# Altium schematic sheet 2024-08-23_02-39-061.schdoc
size 378 x 175 mm; SheetNumber: 1; SheetTotal: 1
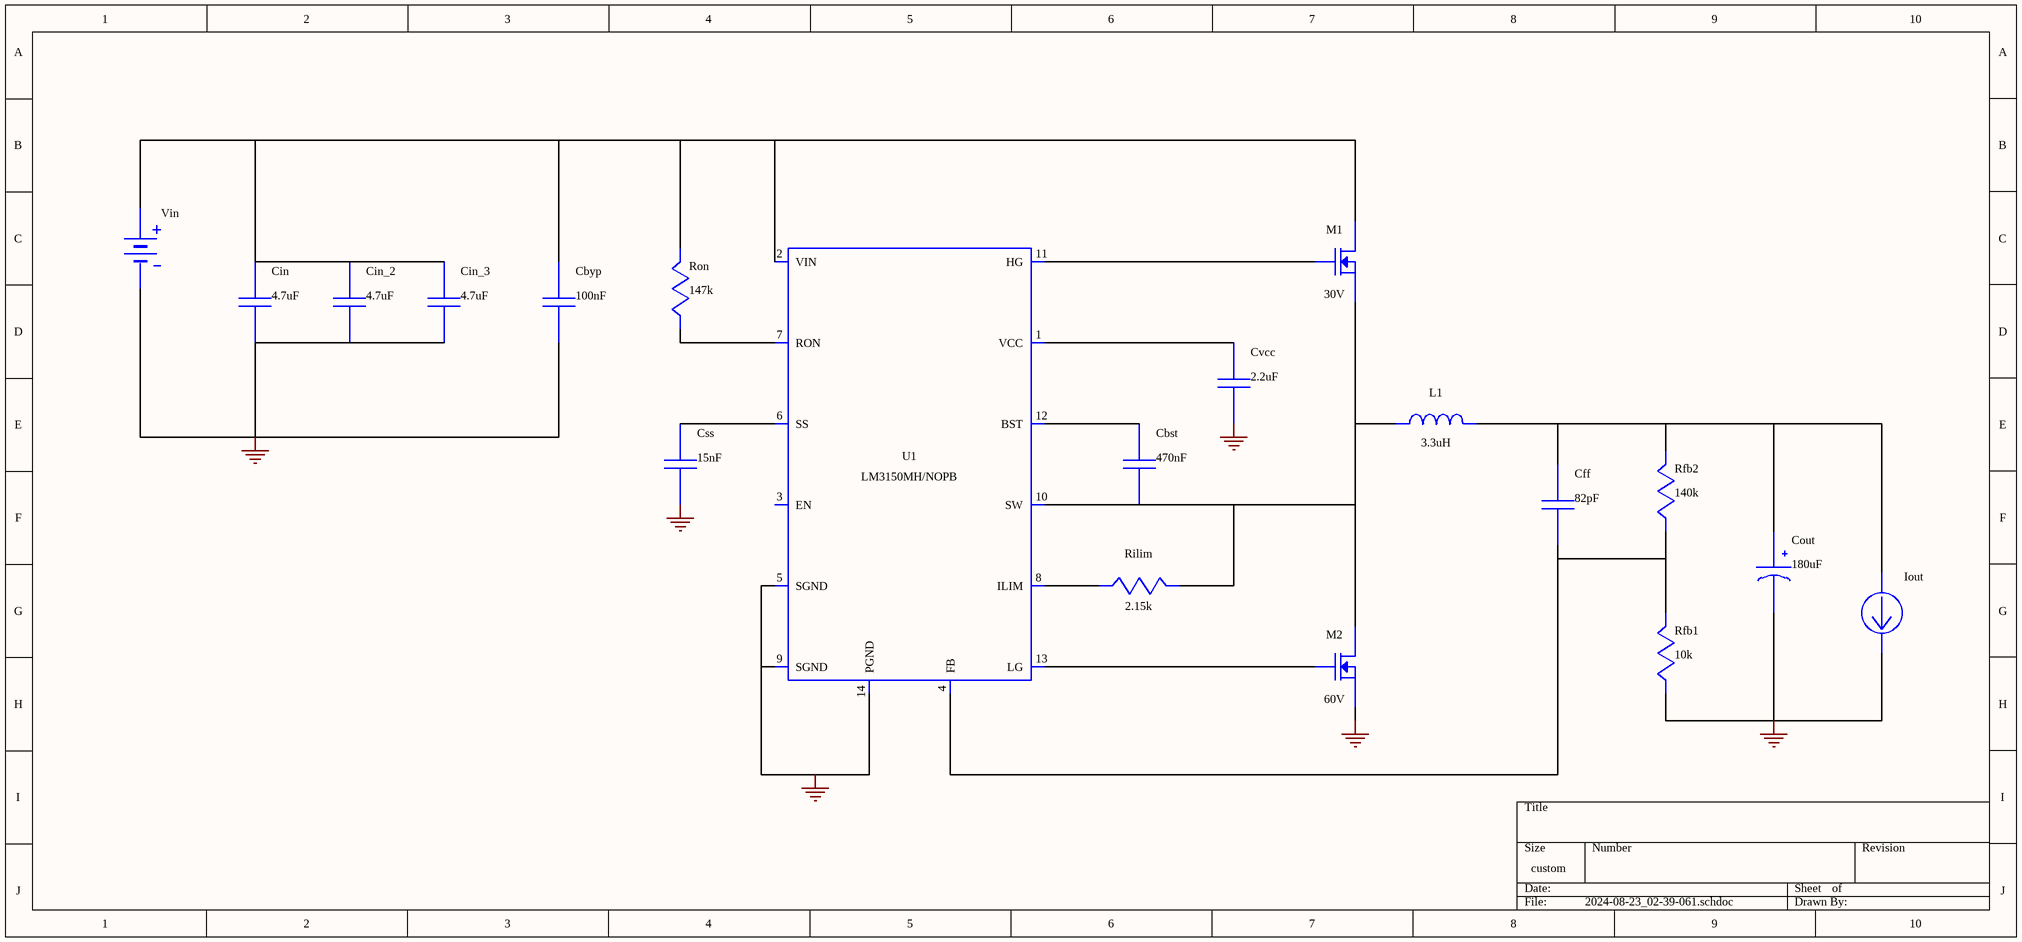
[diagram p0: 2024-08-23_02-39-061.schdoc]

## Parts
Cbst  value 470nF  (hidden comment: ECPU1C474MA5)
Cbyp  value 100nF  (hidden comment: C0805C104M5RACTU)
Cff  value 82pF  (hidden comment: CC0805JRNPO9BN820)
Cin  value 4.7uF  (hidden comment: GRM31CR71H475KA12L)
Cin_2  value 4.7uF  (hidden comment: GRM31CR71H475KA12L)
Cin_3  value 4.7uF  (hidden comment: GRM31CR71H475KA12L)
Cout  value 180uF  (hidden comment: 16SVPE180M)
Css  value 15nF  (hidden comment: C2012C0G1H153J085AA)
Cvcc  value 2.2uF  (hidden comment: GRM21BR71A225KA01L)
Iout  WB_CURRENT_LOAD  (value not drawn)
L1  value 3.3uH  (hidden comment: SRP1270-3R3M)
M1  value 30V  (hidden comment: CSD17302Q5A)
M2  value 60V  (hidden comment: CSD18533Q5A)
Rfb1  value 10k  (hidden comment: ERJ-6ENF1002V)
Rfb2  value 140k  (hidden comment: ERJ-6ENF1403V)
Rilim  value 2.15k  (hidden comment: ERJ-6ENF2151V)
Ron  value 147k  (hidden comment: ERJ-6ENF1473V)
U1  LM3150MH/NOPB
Vin  WB_BATTERY  (value not drawn)

## Nets
0: Cbyp.2 Cin.2 Cin_2.2 Cin_3.2 Cout.2(-) Css.2 Cvcc.2 Iout.2(-) M2.1(Source) M2.2(Source) M2.3(Source) Rfb1.2 U1.5(SGND) U1.9(SGND) U1.14(PGND) U1.15(DAP) Vin.2(-)
NetCbst_1: Cbst.1 U1.12(BST)
NetCbst_2: Cbst.2 L1.1 M1.1(Source) M1.2(Source) M1.3(Source) M2.5(Drain) M2.6(Drain) M2.7(Drain) M2.8(Drain) M2.9(Drain) Rilim.1 U1.10(SW)
NetCbyp_1: Cbyp.1 Cin.1 Cin_2.1 Cin_3.1 M1.5(Drain) M1.6(Drain) M1.7(Drain) M1.8(Drain) M1.9(Drain) Ron.1 U1.2(VIN) Vin.1(+)
NetCff_1: Cff.1 Cout.1(+) Iout.1(+) L1.2 Rfb2.1
NetCff_2: Cff.2 Rfb1.1 Rfb2.2 U1.4(FB)
NetCss_1: Css.1 U1.6(SS)
NetCvcc_1: Cvcc.1 U1.1(VCC)
NetM1_4: M1.4(Gate) U1.11(HG)
NetM2_4: M2.4(Gate) U1.13(LG)
NetRilim_2: Rilim.2 U1.8(ILIM)
NetRon_2: Ron.2 U1.7(RON)

Not connected (* = marked no-connect by the designer): U1 3(EN)

## Library data of the parts
Cbst = ECPU1C474MA5: Manufacturer Name: Panasonic; PackageReference: ECPU1C474MA5; Manufacturer Part Number: ECPU1C474MA5
Cbyp = C0805C104M5RACTU: Manufacturer Name: Kemet; PackageReference: C0805C104M5RACTU; Manufacturer Part Number: C0805C104M5RACTU
Cff = CC0805JRNPO9BN820: CC0805JRNPO9BN82; Manufacturer Name: Yageo; PackageReference: CC0805JRNPO9BN820; Manufacturer Part Number: CC0805JRNPO9BN820
Cin Cin_2 Cin_3 = GRM31CR71H475KA12L: GRM31CR71H475KA1; Manufacturer Name: MuRata; PackageReference: GRM31CR71H475KA12L; Manufacturer Part Number: GRM31CR71H475KA12L
Cout = 16SVPE180M: Manufacturer Name: Panasonic; PackageReference: 16SVPE180M; Manufacturer Part Number: 16SVPE180M
Css = C2012C0G1H153J085AA: C2012C0G1H153J08; Manufacturer Name: TDK; PackageReference: C2012C0G1H153J085AA; Manufacturer Part Number: C2012C0G1H153J085AA
Cvcc = GRM21BR71A225KA01L: GRM21BR71A225KA0; Manufacturer Name: MuRata; PackageReference: GRM21BR71A225KA01L; Manufacturer Part Number: GRM21BR71A225KA01L
L1 = SRP1270-3R3M: Manufacturer Name: Bourns; PackageReference: SRP1270-3R3M; Manufacturer Part Number: SRP1270-3R3M
M1 = CSD17302Q5A: Manufacturer Name: Texas Instruments; PackageReference: CSD17302Q5A; Manufacturer Part Number: CSD17302Q5A
M2 = CSD18533Q5A: Manufacturer Name: Texas Instruments; PackageReference: CSD18533Q5A; Manufacturer Part Number: CSD18533Q5A
Rfb1 = ERJ-6ENF1002V: Manufacturer Name: Panasonic; PackageReference: ERJ-6ENF1002V; Manufacturer Part Number: ERJ-6ENF1002V
Rfb2 = ERJ-6ENF1403V: Manufacturer Name: Panasonic; PackageReference: ERJ-6ENF1403V; Manufacturer Part Number: ERJ-6ENF1403V
Rilim = ERJ-6ENF2151V: Manufacturer Name: Panasonic; PackageReference: ERJ-6ENF2151V; Manufacturer Part Number: ERJ-6ENF2151V
Ron = ERJ-6ENF1473V: Manufacturer Name: Panasonic; PackageReference: ERJ-6ENF1473V; Manufacturer Part Number: ERJ-6ENF1473V
U1 = LM3150MH/NOPB: Manufacturer Name: Texas Instruments; PackageReference: LM3150MH/NOPB; Manufacturer Part Number: LM3150MH/NOPB; Value: N/A
Iout = WB_CURRENT_LOAD: PackageReference: WB_CURRENT_LOAD; Manufacturer Part Number: WB_CURRENT_LOAD; Manufacturer Name: WB_CURRENT_LOAD; Value: N/A
Vin = WB_BATTERY: PackageReference: WB_BATTERY; Manufacturer Part Number: WB_BATTERY; Manufacturer Name: WB_BATTERY; Value: N/A